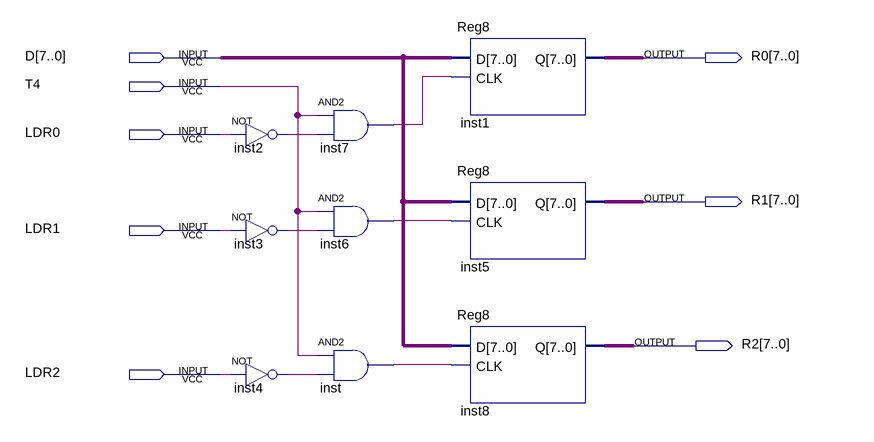
[diagram p0: schematic sheet]
// Quartus schematic Registers_3.bdf as structural Verilog: 9 symbols, 8 pins
module Registers_3 (
  input  [7:0] D,
  input  T4,
  input  LDR0,
  input  LDR1,
  input  LDR2,
  output [7:0] R0,
  output [7:0] R1,
  output [7:0] R2
);

  wire inst2_out, inst3_out, inst4_out, inst6_out, inst7_out, inst_out;

  not inst2 (inst2_out, LDR0);
  not inst3 (inst3_out, LDR1);
  not inst4 (inst4_out, LDR2);
  and inst7 (inst7_out, T4, inst2_out);
  and inst6 (inst6_out, T4, inst3_out);
  and inst (inst_out, T4, inst4_out);
  Reg8 inst1 (.D(D), .CLK(inst7_out), .Q(R0));
  Reg8 inst5 (.D(D), .CLK(inst6_out), .Q(R1));
  Reg8 inst8 (.D(D), .CLK(inst_out), .Q(R2));
endmodule
